# EAGLE design PhonoIn (EAGLE 6.5.0)
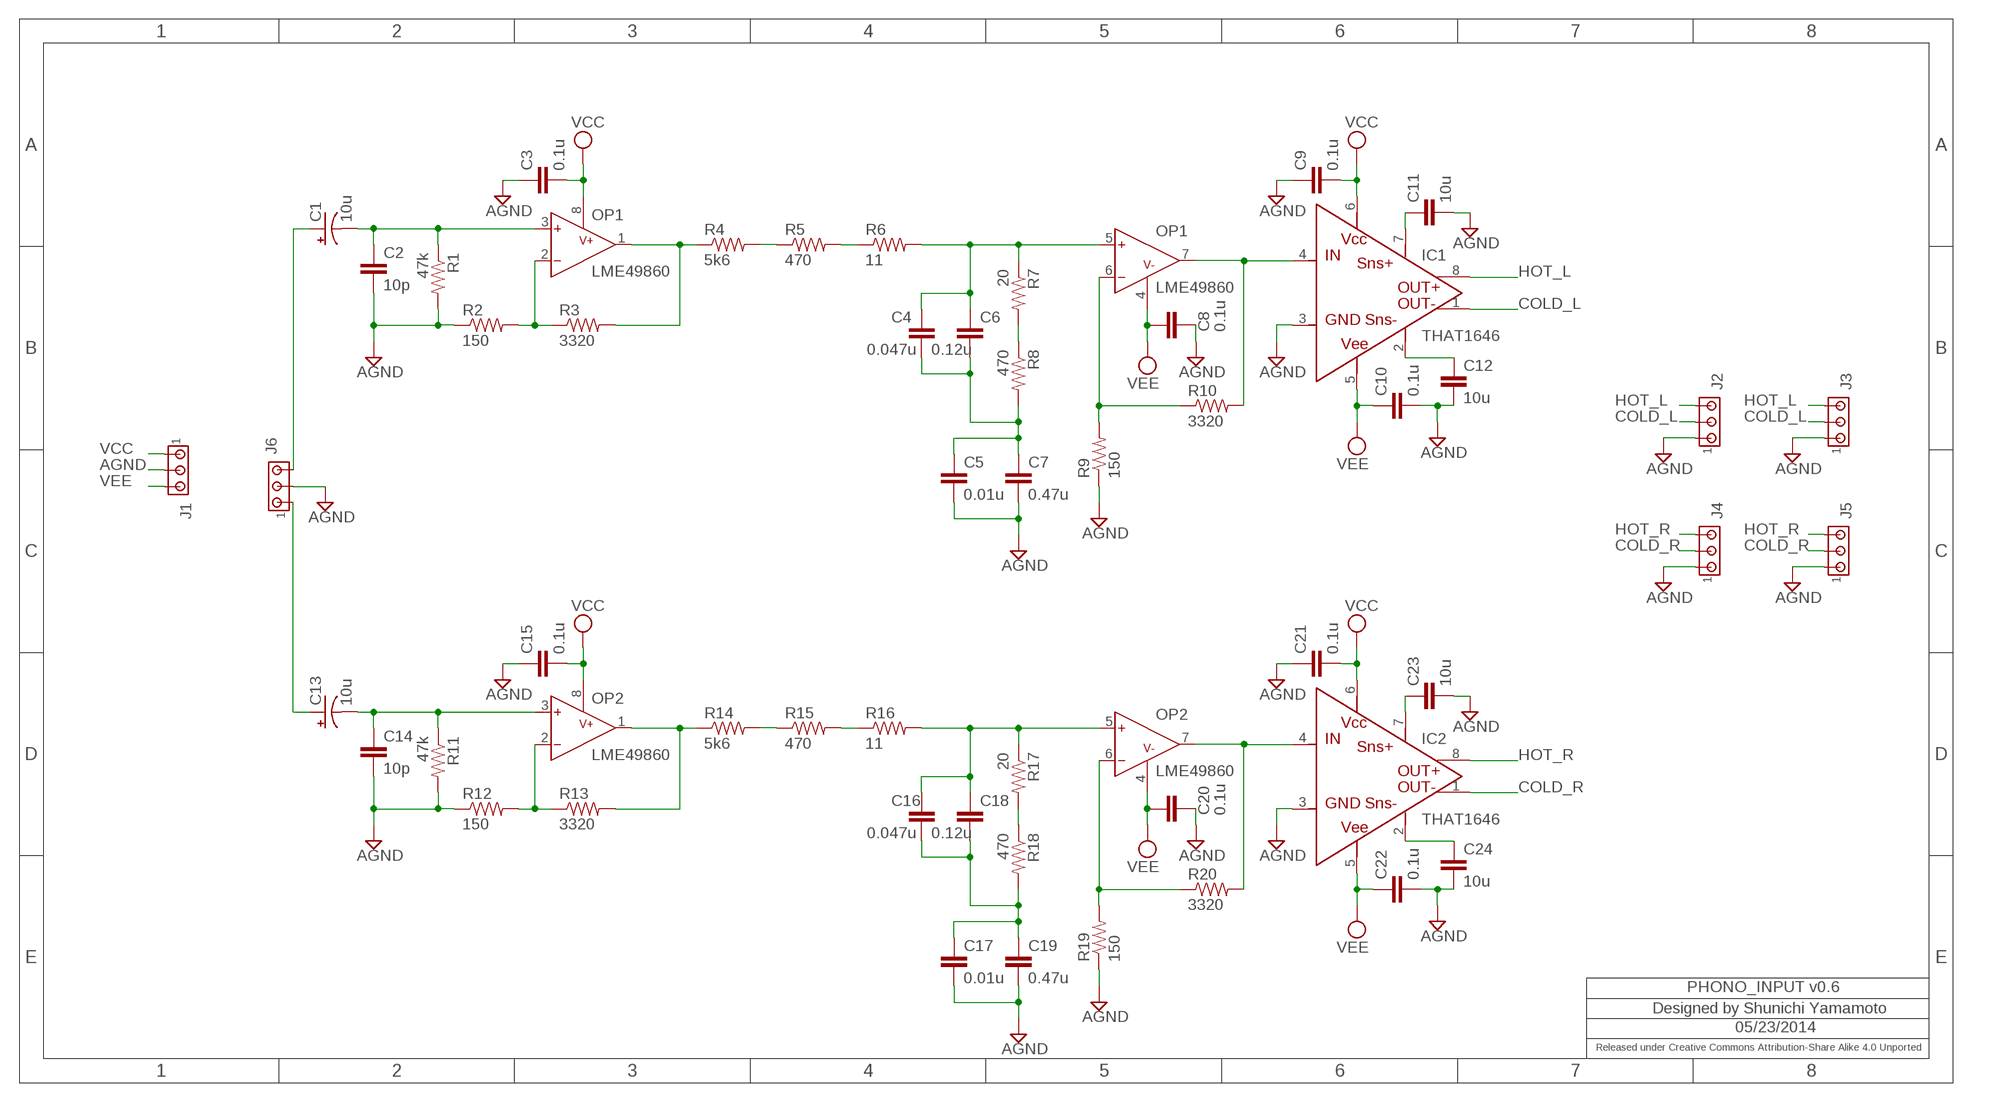
[diagram p0: schematic, sheet 1]

## Parts
C1  10u  CPOL-USUD-5X5,8  [UD-5X5,8_NICHICON]
C2  10p  C-EUC1608  [C1608]
C3  0.1u  C-EUC2012  [C2012]
C4  0.047u  C-EUC4833  [C4833]
C5  0.01u  C-EUC3216  [C3216]
C6  0.12u  C-EUC6041  [C6041]
C7  0.47u  C-EUC5750  [C5750]
C8  0.1u  C-EUC2012  [C2012]
C9  0.1u  C-EUC2012  [C2012]
C10  0.1u  C-EUC2012  [C2012]
C11  10u  C-EUC2012  [C2012]
C12  10u  C-EUC2012  [C2012]
C13  10u  CPOL-USUD-5X5,8  [UD-5X5,8_NICHICON]
C14  10p  C-EUC1608  [C1608]
C15  0.1u  C-EUC2012  [C2012]
C16  0.047u  C-EUC4833  [C4833]
C17  0.01u  C-EUC3216  [C3216]
C18  0.12u  C-EUC6041  [C6041]
C19  0.47u  C-EUC5750  [C5750]
C20  0.1u  C-EUC2012  [C2012]
C21  0.1u  C-EUC2012  [C2012]
C22  0.1u  C-EUC2012  [C2012]
C23  10u  C-EUC2012  [C2012]
C24  10u  C-EUC2012  [C2012]
IC1  THAT1646  [SOIC8]
IC2  THAT1646  [SOIC8]
J1  MTA03-156  [1X3MTA]
J2  MTA03-100  [10X03MTA]
J3  MTA03-100  [10X03MTA]
J4  MTA03-100  [10X03MTA]
J5  MTA03-100  [10X03MTA]
J6  MTA03-100  [10X03MTA]
OP1  LME49860  [SOIC8]
OP2  LME49860  [SOIC8]
R1  47k  RESISTOR0805-RES  [0805]
R2  150  RESISTOR0805-RES  [0805]
R3  3320  RESISTOR0805-RES  [0805]
R4  5k6  RESISTOR0805-RES  [0805]
R5  470  RESISTOR0805-RES  [0805]
R6  11  RESISTOR0805-RES  [0805]
R7  20  RESISTOR0805-RES  [0805]
R8  470  RESISTOR0805-RES  [0805]
R9  150  RESISTOR0805-RES  [0805]
R10  3320  RESISTOR0805-RES  [0805]
R11  47k  RESISTOR0805-RES  [0805]
R12  150  RESISTOR0805-RES  [0805]
R13  3320  RESISTOR0805-RES  [0805]
R14  5k6  RESISTOR0805-RES  [0805]
R15  470  RESISTOR0805-RES  [0805]
R16  11  RESISTOR0805-RES  [0805]
R17  20  RESISTOR0805-RES  [0805]
R18  470  RESISTOR0805-RES  [0805]
R19  150  RESISTOR0805-RES  [0805]
R20  3320  RESISTOR0805-RES  [0805]

## Nets
AGND: C2.2 C3.1 C5.2 C7.P$2 C8.2 C9.1 C10.2 C11.2 C12.2 C14.2 C15.1 C17.2 C19.P$2 C20.2 C21.1 C22.2 C23.2 C24.2 IC1.3(GND) IC2.3(GND) J1.2 J2.1 J3.1 J4.1 J5.1 J6.2 R1.2 R2.1 R9.1 R11.2 R12.1 R19.1
COLD_L: IC1.1(OUT-) J2.2 J3.2
COLD_R: IC2.1(OUT-) J4.2 J5.2
HOT_L: IC1.8(OUT+) J2.3 J3.3
HOT_R: IC2.8(OUT+) J4.3 J5.3
N$1: R5.2 R6.1
N$2: R15.2 R16.1
N$3: C11.1 IC1.7(SNS+)
N$4: C1.- C2.1 OP1.3(INA+) R1.1
N$5: C13.- C14.1 OP2.3(INA+) R11.1
N$6: C23.1 IC2.7(SNS+)
N$7: C12.1 IC1.2(SNS-)
N$8: C24.1 IC2.2(SNS-)
N$9: OP1.2(INA-) R2.2 R3.1
N$10: OP1.1(OUTA) R3.2 R4.1
N$11: C4.2 C5.1 C6.2 C7.P$1 R8.2
N$12: C1.+ J6.3
N$13: R4.2 R5.1
N$14: C4.1 C6.1 OP1.5(INB+) R6.2 R7.1
N$15: R7.2 R8.1
N$16: OP1.6(INB-) R9.2 R10.1
N$17: C13.+ J6.1
N$18: OP2.2(INA-) R12.2 R13.1
N$19: OP2.1(OUTA) R13.2 R14.1
N$21: R14.2 R15.1
N$22: C16.1 C18.1 OP2.5(INB+) R16.2 R17.1
N$23: R17.2 R18.1
N$24: C16.2 C17.1 C18.2 C19.P$1 R18.2
N$25: OP2.6(INB-) R19.2 R20.1
PIN_L: IC1.4(IN) OP1.7(OUTB) R10.2
PIN_R: IC2.4(IN) OP2.7(OUTB) R20.2
VCC: C3.2 C9.2 C15.2 C21.2 IC1.6(VCC) IC2.6(VCC) J1.1 OP1.8(V+) OP2.8(V+)
VEE: C8.1 C10.1 C20.1 C22.1 IC1.5(VEE) IC2.5(VEE) J1.3 OP1.4(V-) OP2.4(V-)

## Notes on the sheet
- PHONO_INPUT v0.6
- Designed by Shunichi Yamamoto
- 05/23/2014
- Released under Creative Commons Attribution-Share Alike 4.0 Unported

## Library data of the parts
C1 C13 = rcl:CPOL-US: POLARIZED CAPACITOR, American symbol
C2-C12 C14-C24 = rcl:C-EU: CAPACITOR, European symbol
IC1 IC2 = thatcorp:THAT1646
J1 = con-amp:MTA03-156: AMP connector
J2-J6 = con-amp:MTA03-100: AMP connector
OP1 OP2 = thatcorp:LME49860
R1-R20 = SparkFun:RESISTOR: Resistor Basic schematic elements and footprints for 0603, 1206, and PTH resistors.

## Board
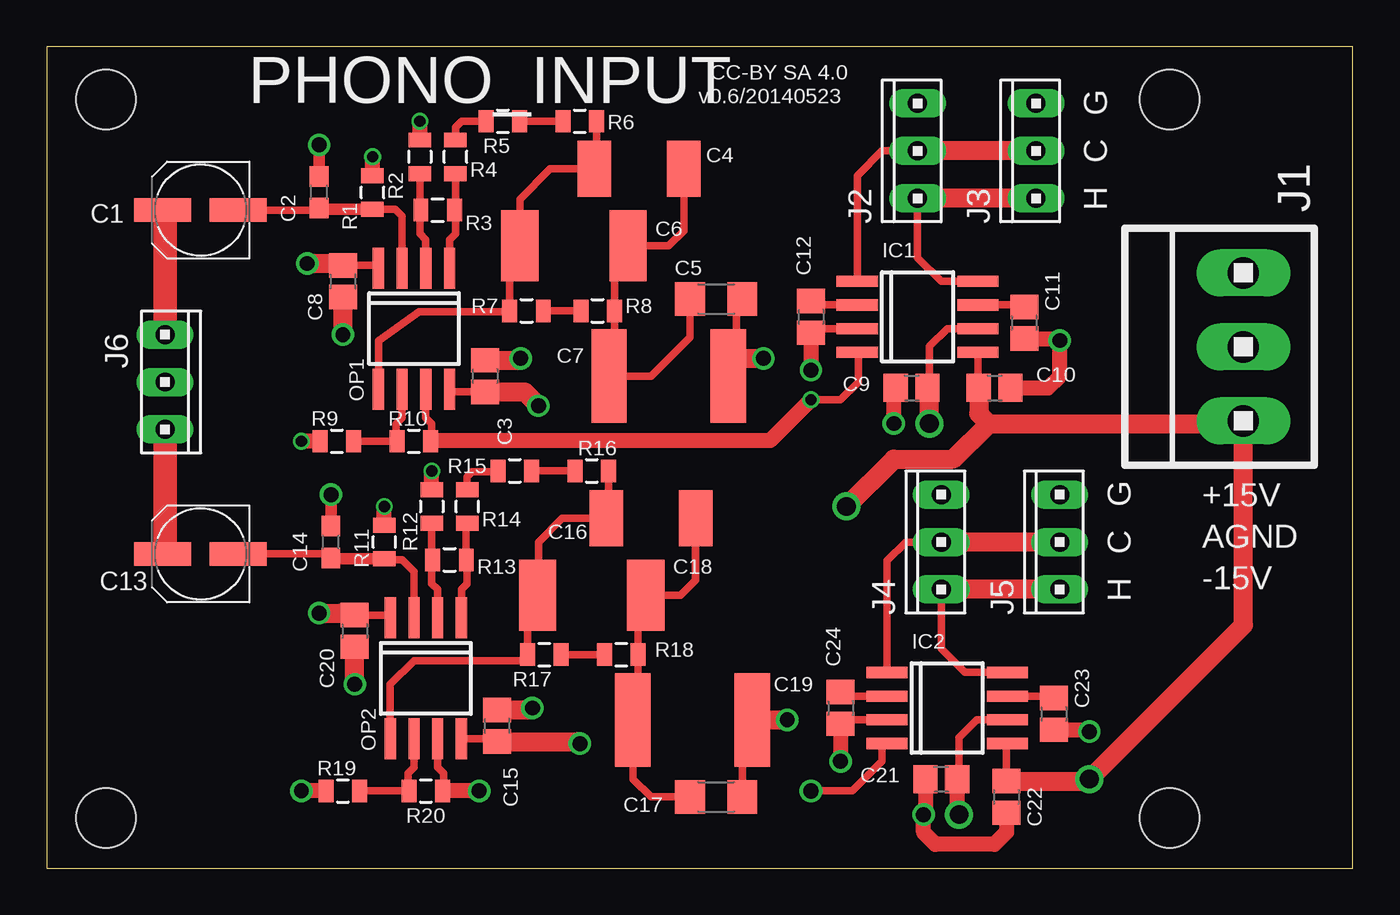
[diagram p1: board, top side]
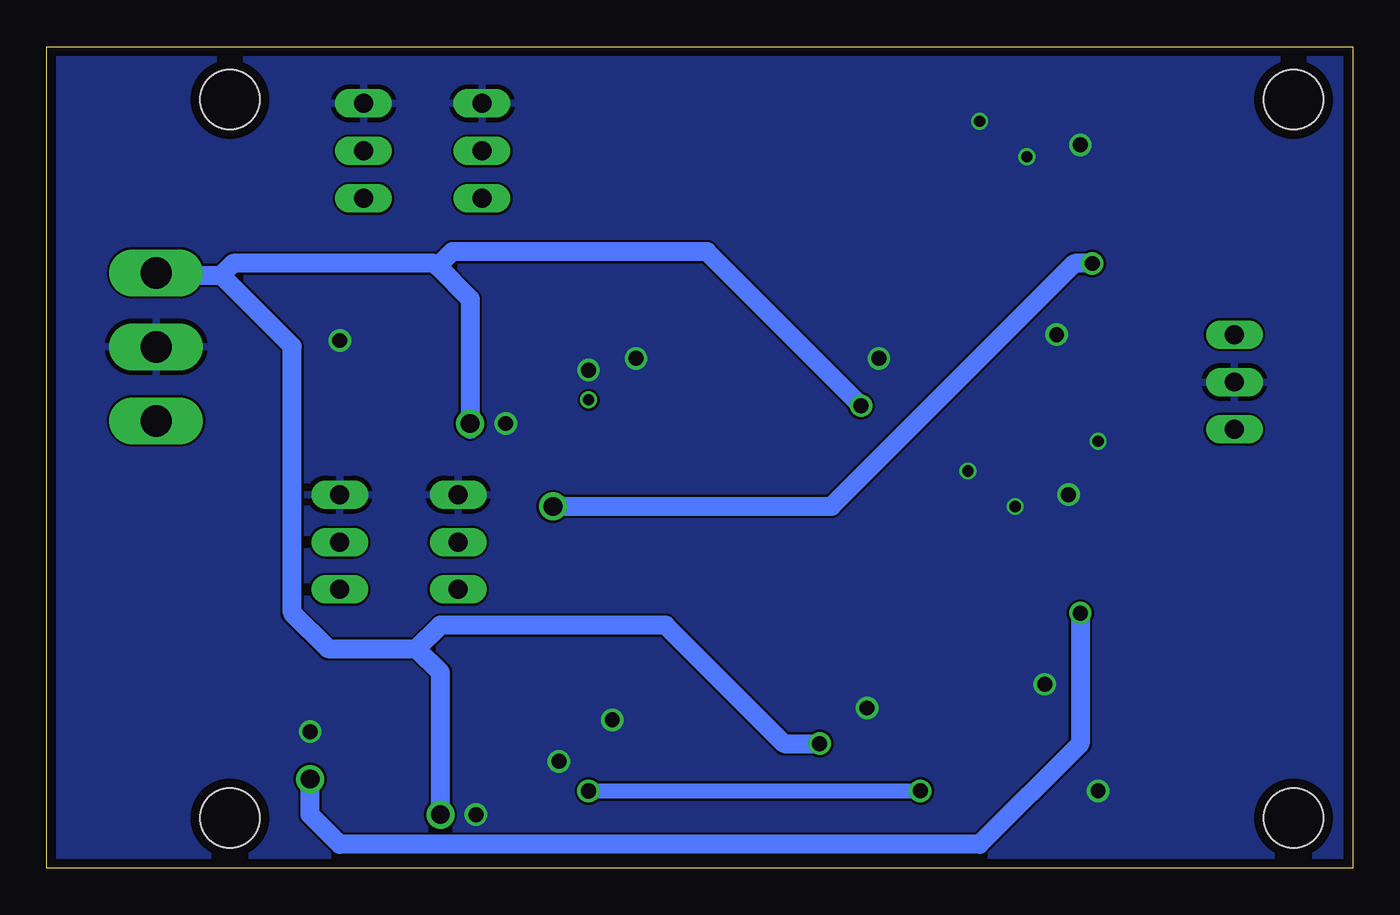
[diagram p2: board, bottom side, seen from below]

Size 70 x 44 mm. Coordinates in mm from the lower left corner, seen from the top.
Outline: 0,0 70,0 70,44 0,44 0,0
Copper layers (1*16): Top 0.035mm / dielectric 1.53mm / Bottom 0.035mm
Design rules "pban_5mil-l2": minimum track width 5mil, minimum drill 0.3mm, track to track 5mil, track to pad 0.229mm, pad to pad 5mil, via to via 5mil, smd to smd 5mil, copper to edge 0.5mm, drill to drill 0.5mm, minimum pad ring 0.15mm, minimum via ring 0.15mm, stop-mask expansion 4mil, vias tented up to drill 0.35mm, thermal gap 10mil
Holes 3.2 mm at 60.17,41.17 60.17,2.67 3.17,41.17 3.17,2.67

### Footprints (pad centres in the part's own frame; a part is rotated, then mirrored left to right if it is on the bottom)
UD-5X5,8_NICHICON = smd 3.048 x 1.27: + 2.042,0; - -2.018,0
C1608 = smd 1.1 x 1: 1 -0.85,0; 2 0.85,0
C2012 = smd 1.3 x 1.5: 1 -0.85,0; 2 0.85,0
C4833 = smd 1.8 x 3: 1 -2.4,0; 2 2.4,0
C3216 = smd 1.6 x 1.8: 1 -1.4,0; 2 1.4,0
C6041 = smd 2 x 3.8: 1 -2.9,0; 2 2.9,0
C5750 = smd 1.9 x 5: P$1 -3.2,0; P$2 3.2,0
SOIC8 = smd 0.6 x 2.2: 1 -1.905,-3.235; 2 -0.635,-3.235; 3 0.635,-3.235; 4 1.905,-3.235; 5 1.905,3.235; 6 0.635,3.235; 7 -0.635,3.235; 8 -1.905,3.235
1X3MTA = drill 1.676 long: 1 3.937,0; 2 -0.025,0; 3 -3.988,0
10X03MTA = drill 1.016 long: 1 2.54,0; 2 0,0; 3 -2.54,0
0805 = smd 0.8 x 1.2: 1 -0.9,0; 2 0.9,0

### Placement (x,y rotation side)
C1  8.26,35.24 180 top
C2  14.61,36.2 90 top
C3  23.5,26.35 270 top
C4  31.75,37.47 0 top
C5  35.88,30.48 0 top
C6  28.26,33.34 0 top
C7  33.34,26.35 0 top
C8  15.88,31.43 270 top
C9  46.35,25.72 0 top
C10  50.8,25.72 0 top
C11  52.39,29.21 270 top
C12  40.96,29.53 270 top
C13  8.26,16.83 180 top
C14  15.24,17.46 90 top
C15  24.13,7.62 270 top
C16  32.38,18.73 0 top
C17  35.88,3.81 0 top
C18  29.21,14.61 0 top
C19  34.61,7.94 0 top
C20  16.51,12.7 270 top
C21  47.94,4.76 0 top
C22  51.44,3.81 270 top
C23  53.98,8.26 270 top
C24  42.55,8.57 270 top
IC1  46.67,29.53 270 top
IC2  48.26,8.57 270 top
J1  64.14,27.94 90 top
J2  46.67,38.42 90 top
J3  53.02,38.42 90 top
J4  47.94,17.46 90 top
J5  54.29,17.46 90 top
J6  6.35,26.04 270 top
OP1  19.68,28.89 180 top
OP2  20.32,10.16 180 top
R1  17.46,36.2 90 top
R2  20,38.1 270 top
R3  20.95,35.24 0 top
R4  21.91,38.1 90 top
R5  24.45,40.01 0 top
R6  28.57,40.01 0 top
R7  25.72,29.84 0 top
R8  29.53,29.84 0 top
R9  15.56,22.86 0 top
R10  19.68,22.86 0 top
R11  18.1,17.46 90 top
R12  20.64,19.37 270 top
R13  21.59,16.51 0 top
R14  22.54,19.37 90 top
R15  25.08,21.27 0 top
R16  29.21,21.27 0 top
R17  26.67,11.43 0 top
R18  30.8,11.43 0 top
R19  15.88,4.13 0 top
R20  20.32,4.13 0 top

### Tracks (layer width: path | path; a pad name or v marks a point on that pad's centre or on a via)
AGND  (via drill 0.6, 0.8)
  Top 0.406: 36.41,27.48 36.96,28.03 36.96,30.48 C5.2 | C17.2 37.28,7.41 C19.P$2 | 36.24,27.3 36.24,26.65 C7.P$2 | IC1.3 41.17,28.89 C12.2 | IC2.3 42.76,7.94 C24.2
  Top 0.61: 36.41,27.48 36.24,27.3 | C14.2 v15.24,20 | C2.2 v14.61,38.73
  Top 0.813: R9.1 v13.65,22.86 | R19.1 v13.65,4.13 | R11.2 v18.1,19.37 | R12.1 v20.64,21.27 | R2.1 v20,40.01 | R1.2 v17.46,38.1 | v45.4,23.81 45.4,25.61 C9.1 | C12.2 v40.96,26.67 | C24.2 v42.55,5.71 | C21.1 47.09,2.96 v46.99,2.86 46.99,1.91 47.62,1.27 50.8,1.27 51.44,1.91 C22.2 | C11.2 54.19,28.36 v54.29,28.26 54.29,26.35 53.66,25.72 C10.2 | C23.2 55.78,7.41 v55.88,7.3
  Top 1.016: C15.1 25.93,8.47 v26.04,8.57 | v15.88,28.57 C8.2 | v16.51,9.84 C20.2 | C3.1 25.3,27.2 v25.4,27.3 | 36.24,27.3 v38.42,27.3 | C19.P$2 v39.69,7.94
  pour Bottom: -0.32,44.13 -0.32,-0.32 70.04,-0.32 70.04,44.13
COLD_L
  Top 0.406: IC1.1 43.44,37.09 44.77,38.42 J2.2
  Top 1.016: J3.2 J2.2
COLD_R
  Top 0.406: IC2.1 45.02,16.45 46.04,17.46 J4.2
  Top 1.016: J5.2 J4.2
HOT_L
  Top 0.406: IC1.8 47.94,31.43 46.67,32.7 J2.3
  Top 1.016: J3.3 J2.3
HOT_R
  Top 0.406: IC2.8 49.21,10.48 47.94,11.75 J4.3
  Top 1.016: J5.3 J4.3
N$1
  Top 0.406: R5.2 R6.1
N$2
  Top 0.406: R15.2 R16.1
N$3
  Top 0.406: IC1.7 52.28,30.16 C11.1
N$4
  Top 0.406: R1.1 18.68,35.3 19.05,34.92 OP1.3 | C1.- 14.5,35.24 C2.1
  Top 0.61: R1.1 14.65,35.3 C2.1
N$5
  Top 0.406: OP2.3 19.68,15.88 19.05,16.51 18.15,16.51 R11.1 | C13.- 15.03,16.83 C14.1
  Top 0.61: R11.1 15.29,16.56 C14.1
N$6
  Top 0.406: IC2.7 53.87,9.21 C23.1
N$7
  Top 0.406: IC1.2 41.17,30.16 C12.1
N$8
  Top 0.406: IC2.2 42.76,9.21 C24.1
N$9
  Top 0.406: OP1.2 20.32,33.66 20,33.97 20,35.19 R3.1 20,35.3 R2.2
N$10
  Top 0.406: OP1.1 21.59,33.66 21.91,33.97 21.91,35.19 R3.2 21.91,35.24 R4.1
N$11
  Top 0.406: C4.2 34.15,34.15 33.34,33.34 C6.2 30.43,32.61 R8.2 30.43,26.64 C7.P$1 32.38,26.35 34.48,28.45 C5.1
N$12
  Top 1.27: J6.3 6.35,35.1 C1.+
N$13
  Top 0.406: R5.1 22.23,40.01 21.91,39.69 R4.2
N$14
  Top 0.406: OP1.5 17.78,28.26 19.95,29.79 24.77,29.79 R7.1 24.82,32.8 C6.1 | R6.2 29.48,37.27 C4.1 26.99,37.47 25.36,35.84 C6.1 | 25.5,33.19 C6.1
N$15
  Top 0.406: R7.2 R8.1
N$16
  Top 0.406: OP1.6 19.05,24.13 18.73,23.81 18.73,22.91 R10.1 R9.2
N$17
  Top 1.27: J6.1 6.35,16.96 C13.+
N$18
  Top 0.406: OP2.2 20.95,14.92 20.64,15.24 20.64,16.46 R13.1 20.64,16.56 R12.2
N$19
  Top 0.406: OP2.1 22.23,14.92 22.54,15.24 22.54,16.46 R13.2 22.49,18.41 R14.1
N$21
  Top 0.406: R15.1 24.13,21.22 22.81,21.22 22.54,20.95 R14.2
N$22
  Top 0.406: OP2.5 18.41,9.84 19.68,11.11 25.45,11.11 R17.1 25.77,14.06 C18.1 26.35,14.65 26.35,17.46 27.62,18.73 C16.1 30.11,18.54 R16.2
N$23
  Top 0.406: R17.2 R18.1
N$24
  Top 0.406: C16.2 34.78,15.42 33.97,14.61 C18.2 31.7,14.19 R18.2 31.7,8.23 C19.P$1 31.43,7.91 31.43,4.76 32.38,3.81 C17.1
N$25
  Top 0.406: OP2.6 19.68,5.4 19.37,5.08 19.37,4.18 R20.1 R19.2
PIN_L  (via drill 0.6)
  Top 0.406: OP1.7 20.32,24.13 20.64,23.81 20.64,22.91 R10.2 | v40.96,25.08 42.55,25.08 43.5,26.04 43.5,27.56 IC1.4
  Top 0.813: 20.64,22.91 38.79,22.91 v40.96,25.08
PIN_R  (via drill 0.8, 0.81)
  Top 0.406: OP2.7 20.95,5.4 21.27,5.08 21.27,4.18 R20.2 | v40.96,4.13 43.18,4.13 44.77,5.71 44.77,6.41 IC2.4
  Top 0.813: v23.18,4.13 R20.2
  Bottom 0.813: v40.96,4.13 v23.18,4.13
VCC  (via drill 0.8, 1)
  Top 0.406: C3.2 21.75,25.5 OP1.8 | OP2.8 24.61,6.92 C15.2 | IC1.6 48.26,28.89 47.31,27.94 47.31,25.82 C9.2 | IC2.6 49.85,7.94 48.9,6.99 48.9,4.87 C21.2
  Top 0.813: C21.2 48.79,2.96 v48.9,2.86
  Top 1.016: C3.2 25.61,25.5 v26.35,24.77 | C15.2 28.47,6.77 v28.57,6.67 | v47.31,23.81 47.31,25.61 C9.2
  Bottom 1.016: v28.57,6.67 30.48,6.67 36.83,13.02 48.9,13.02 50.16,11.75 | J1.1 64.01,31.75 60.64,31.75 | v48.9,2.86 48.9,10.48 50.16,11.75 | 47.31,23.5 v47.31,23.81 47.31,30.48 49.05,32.23 | 49.05,32.23 49.21,32.38 60.01,32.38 60.64,31.75 | 60.64,31.75 56.83,27.94 56.83,13.65 54.93,11.75 50.16,11.75 | v26.35,24.77 34.61,33.02 48.26,33.02 49.05,32.23
VEE  (via drill 0.8, 1)
  Top 0.406: C8.1 17.62,32.28 OP1.4 | C20.1 18.26,13.55 OP2.4 | IC2.5 51.44,6.61 C22.1 | IC1.5 49.91,25.76 C10.1
  Top 1.016: v14.61,13.65 15.77,13.65 C20.1 | v13.97,32.38 15.14,32.38 C8.1 | 63.96,24.13 J1.3 | J1.3 64.14,13.02 55.78,4.66 | C10.1 49.95,24.34 50.48,23.81 | 50.48,23.81 63.99,23.81 J1.3 | C22.1 55.78,4.66 | v42.86,19.37 45.4,21.91 48.58,21.91 50.48,23.81 | v55.88,4.76 55.88,4.56 55.78,4.66
  Bottom 1.016: v13.97,32.38 14.92,32.38 27.94,19.37 v42.86,19.37 | v14.61,13.65 14.61,6.67 20,1.27 54.29,1.27 55.88,2.86 v55.88,4.76

### Text on the board
tNames: CC-BY SA 4.0 | PHONO_INPUT | v0.6/20140523 | G | C | H | G | +15V | C | AGND | -15V | H